# EAGLE schematic CAN-USB_adapter (EAGLE 6.4)
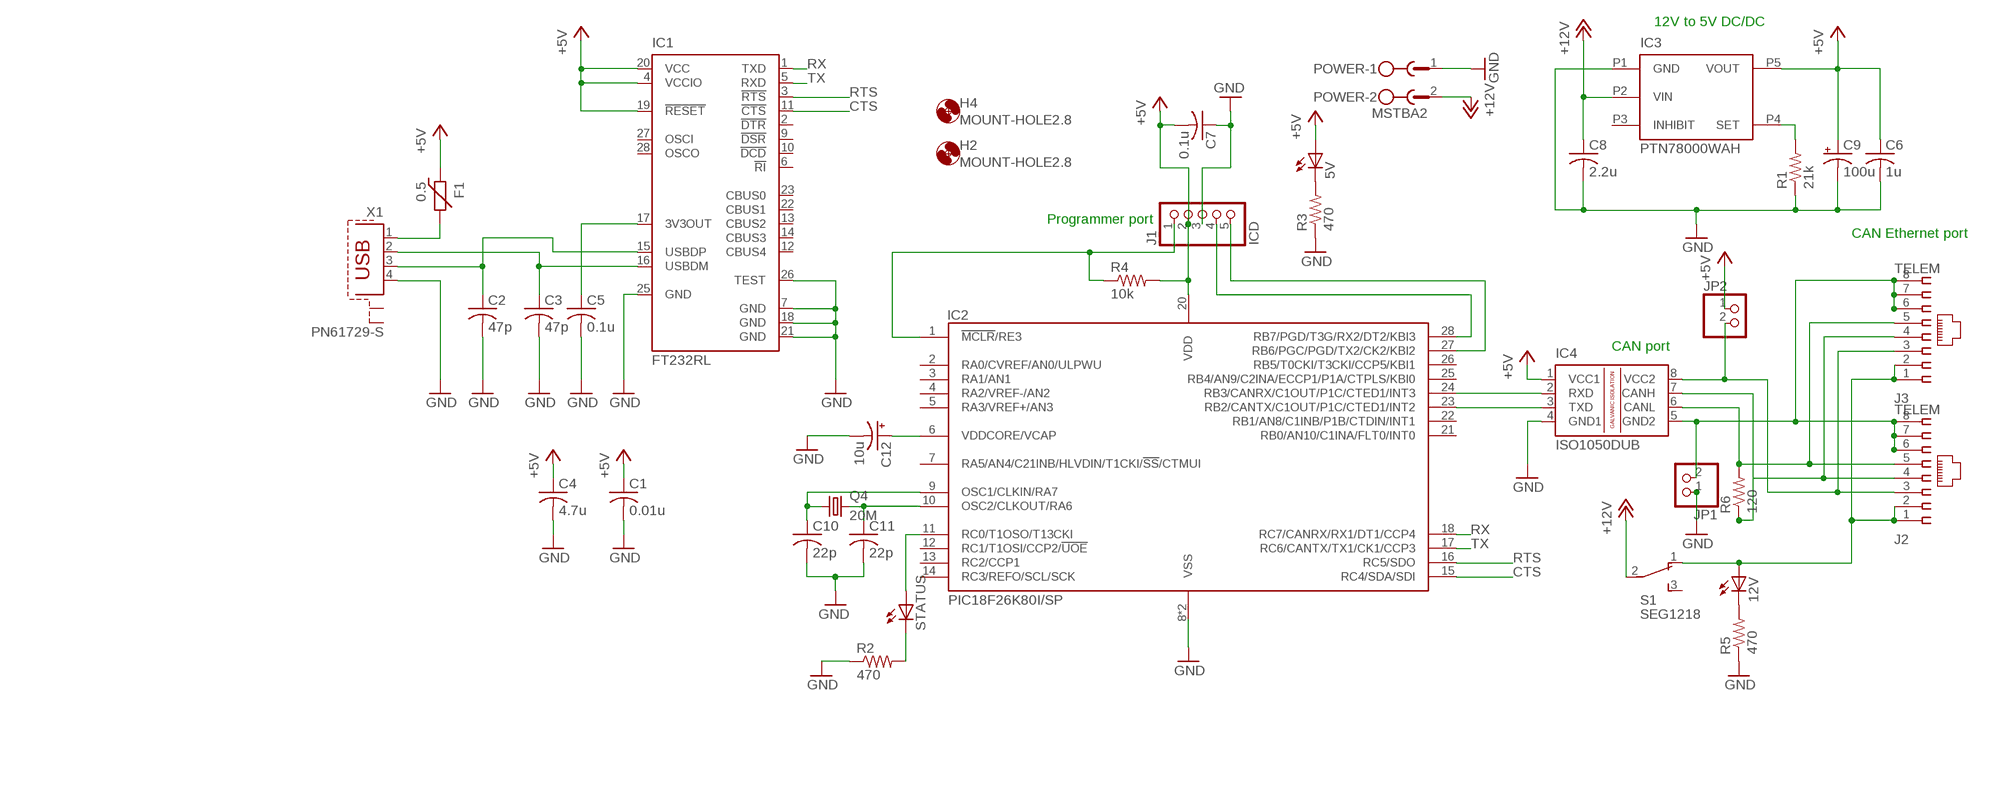
[diagram p0: schematic, sheet 1]

## Parts
5V  LED5MM  [LED5MM]
12V  LED5MM  [LED5MM]
C1  0.01u  C-USC0805  [C0805]
C2  47p  C-USC0805  [C0805]
C3  47p  C-USC0805  [C0805]
C4  4.7u  C-USC0805  [C0805]
C5  0.1u  C-USC0805  [C0805]
C6  1u  C-USC0805  [C0805]
C7  0.1u  C-USC0805  [C0805]
C8  2.2u  C-USC1206  [C1206]
C9  100u  CPOL-USSMCD  [SMC_D]
C10  22p  C-USC0805  [C0805]
C11  22p  C-USC0805  [C0805]
C12  10u  CPOL-USTT2D4  [TT2D4]
F1  0.5  PTC0ZCA  [F1206]
H2  MOUNT-HOLE2.8  [2,8]
H4  MOUNT-HOLE2.8  [2,8]
IC1  FT232RL  [SSOP28]
IC2  PIC18F26K80I/SP  [DIL28/3]
IC3  PTN78000WAH  [PTN78000]
IC4  ISO1050DUB  [DUB-R-PDSO-G8]
J1  ICD  PINHD-1X5  [1X05]
J2  TELEM  215877-7  [215877-7]
J3  TELEM  215877-7  [215877-7]
JP1  PINHD-1X2  [1X02]
JP2  PINHD-1X2  [1X02]
POWER  MSTBA2  [MSTBA2]
Q4  20M  CRYSTALHC49S  [HC49/S]
R1  21k  R-US_R0805  [R0805]
R2  470  R-US_R0805  [R0805]
R3  470  R-US_R0805  [R0805]
R4  10k  R-US_R0805  [R0805]
R5  470  R-US_R0805  [R0805]
R6  120  R-US_0207/7  [0207/7]
S1  SEG1218  [EG1218]
STATUS  LED5MM  [LED5MM]
X1  PN61729-S  [PN61729-S]

## Nets
+5V: 5V.A C1.1 C4.1 C6.1 C7.2 C9.+ F1.1 IC1.4(VCCIO) IC1.19(!RESET) IC1.20(VCC) IC2.20(VDD) IC3.P5(VOUT) IC4.1(VCC1) J1.2 JP2.1 R4.2
+12V: C8.1 IC3.P2(VIN) POWER.2 S1.2(P)
CTS: IC1.11(!CTS) IC2.15(RC4/SDA/SDI)
GND: C1.2 C2.2 C3.2 C4.2 C5.2 C6.2 C7.1 C8.2 C9.- C10.2 C11.2 C12.- IC1.7(GND) IC1.18(GND) IC1.21(GND) IC1.25(GND) IC1.26(TEST) IC2.8(VSS) IC2.19(VSS) IC3.P1(GND) IC4.4(GND1) J1.3 JP1.1 POWER.1 R1.1 R2.1 R3.1 R5.1 X1.4
N$1: C3.1 IC1.16(USBDM) X1.2
N$2: C2.1 IC1.15(USBDP) X1.3
N$3: C5.1 IC1.17(3V3OUT)
N$4: IC2.28(RB7/PGD/T3G/RX2/DT2/KBI3) J1.4
N$5: IC2.27(RB6/PGC/PGD/TX2/CK2/KBI2) J1.5
N$6: IC2.24(RB3/CANRX/C1OUT/P1C/CTED1/INT3) IC4.2(RXD)
N$7: F1.2 X1.1
N$8: IC3.P4(SET) R1.2
N$9: IC2.23(RB2/CANTX/C1OUT/P1C/CTED1/INT2) IC4.3(TXD)
N$10: R2.2 STATUS.K(C)
N$11: C10.1 IC2.9(OSC1/CLKIN/RA7) Q4.1
N$12: C11.1 IC2.10(OSC2/CLKOUT/RA6) Q4.2
N$13: IC2.11(RC0/T1OSO/T13CKI) STATUS.A
N$14: C12.+ IC2.6(VDDCORE/VCAP)
N$15: 5V.K(C) R3.2
N$16: 12V.A J2.1 J2.2 J3.1 J3.2 S1.1(O)
N$17: 12V.K(C) R5.2
N$18: IC4.8(VCC2) J2.3 J3.3 JP2.2
N$20: IC2.1(!MCLR!/RE3) J1.1 R4.1
N$21: IC4.5(GND2) J2.6 J2.7 J2.8 J3.6 J3.7 J3.8 JP1.2
N$26: IC4.7(CANH) J2.4 J3.4 R6.1
N$58: IC4.6(CANL) J2.5 J3.5 R6.2
RTS: IC1.3(!RTS) IC2.16(RC5/SDO)
RX: IC1.1(TXD) IC2.18(RC7/CANRX/RX1/DT1/CCP4)
TX: IC1.5(RXD) IC2.17(RC6/CANTX/TX1/CK1/CCP3)
Unconnected: IC1.2(!DTR) IC1.6(!RI) IC1.9(!DSR) IC1.10(!DCD) IC1.12(CBUS4) IC1.13(CBUS2) IC1.14(CBUS3) IC1.22(CBUS1) IC1.23(CBUS0) IC1.27(OSCI) IC1.28(OSCO) IC2.2(RA0/CVREF/AN0/ULPWU) IC2.3(RA1/AN1) IC2.4(RA2/VREF-/AN2) IC2.5(RA3/VREF+/AN3) IC2.7(RA5/AN4/C21INB/HLVDIN/T1CKI/!SS!/CTMUI) IC2.12(RC1/T1OSI/CCP2/!UOE!) IC2.13(RC2/CCP1) IC2.14(RC3/REFO/SCL/SCK) IC2.21(RB0/AN10/C1INA/FLT0/INT0) IC2.22(RB1/AN8/C1INB/P1B/CTDIN/INT1) IC2.25(RB4/AN9/C2INA/ECCP1/P1A/CTPLS/KBI0) IC2.26(RB5/T0CKI/T3CKI/CCP5/KBI1) IC3.P3(INHIBIT) S1.3(S) X1.S1 X1.S2

## Notes on the sheet
- 12V to 5V DC/DC
- Programmer port
- CAN Ethernet port
- CAN port
- D:/Users/Solar Car/Pictures/logosquare copy.bmp
- D:/Users/Solar Car/Pictures/logosquare copy.bmp

## Library data of the parts
5V 12V STATUS = adafruit:LED: LED OSRAM: - CHIPLED LG R971, LG N971, LY N971, LG Q971, LY Q971, LO R971, LY R971 LH N974, LH R974 LS Q976, LO Q976, LY Q976 LO Q996 - Hyper CHIPLED LW Q18S LB Q993, LB Q99A, LB R99A - SideLED LS A670, LO A670, LY A670, LG A670, LP A670 LB A673, LV A673, LT A673, LW A673 LH A674 LY A675 LS A676, LA A676, LO A676, LY A676, LW A676 LS A679, LY A679, LG A679 - Hyper Micro SIDELED® LS Y876, LA Y876, LO Y876, LY Y876 LT Y87S - SmartLED LW L88C, LW L88S LB L89C, LB L89S, LG L890 LS L89K, LO L89K, LY L89K LS L896, LA L896, LO L896, LY L896 - TOPLED LS T670, LO T670, LY T670, LG T670, LP T670 LSG T670, LSP T670, LSY T670, LOP T670, LYG T670 LG T671, LOG T671, LSG T671 LB T673, LV T673, LT T673, LW T673 LH T674 LS T676, LA T676, LO T676, LY T676, LB T676, LH T676, LSB T676, LW T676 LB T67C, LV T67C, LT T67C, LS T67K, LO T67K, LY T67K, LW E67C LS E67B, LA E67B, LO E67B, LY E67B, LB E67C, LV E67C, LT E67C LW T67C LS T679, LY T679, LG T679 LS T770, LO T770, LY T770, LG T770, LP T770 LB T773, LV T773, LT T773, LW T773 LH T774 LS E675, LA E675, LY E675, LS T675 LS T776, LA T776, LO T776, LY T776, LB T776 LHGB T686 LT T68C, LB T68C - Hyper Mini TOPLED® LB M676 - Mini TOPLED Santana® LG M470 LS M47K, LO M47K, LY M47K Source: http://www.osram.convergy.de/
C1-C5 = resistor:C-US: CAPACITOR, American symbol
C6-C8 C10 C11 = rcl:C-US: CAPACITOR, American symbol
C9 C12 = rcl:CPOL-US: POLARIZED CAPACITOR, American symbol
F1 = MSCP_2011_v2:PTC
H2 H4 = holes:MOUNT-HOLE: MOUNTING HOLE with drill center marker
IC1 = MSCP_2011_v2:FT232R
IC2 = MSCP_2011_v2:PIC18F26K80
IC3 = MSCP_2011_v1:PTN78000WAH
IC4 = texas:ISO1050: ISOLATED CAN TRANSCEIVER Source: http://focus.ti.com/lit/ds/symlink/iso1050.pdf; MPN: ISO1050DUBR; OC_FARNELL: 1755712; OC_NEWARK: 14R9899
J1 = pinhead:PINHD-1X5: PIN HEADER
J2 J3 = con-amp:215877-7: AMP connector
JP1 JP2 = pinhead:PINHD-1X2: PIN HEADER
POWER = con-phoenix-508:MSTBA2: PHOENIX; MF: FARNELL; MPN: 1757242; OC_FARNELL: 3705171; OC_NEWARK: 71C4161
Q4 = crystal:CRYSTAL: CRYSTAL; OC_FARNELL: 1667008; OC_NEWARK: unknown
R1-R5 = rcl:R-US_: RESISTOR, American symbol
R6 = adafruit:R-US_: RESISTOR, American symbol
S1 = MSCP_2011_v2:S
X1 = con-berg:PN61729-S: BERG USB connector; OC_FARNELL: unknown; OC_NEWARK: unknown